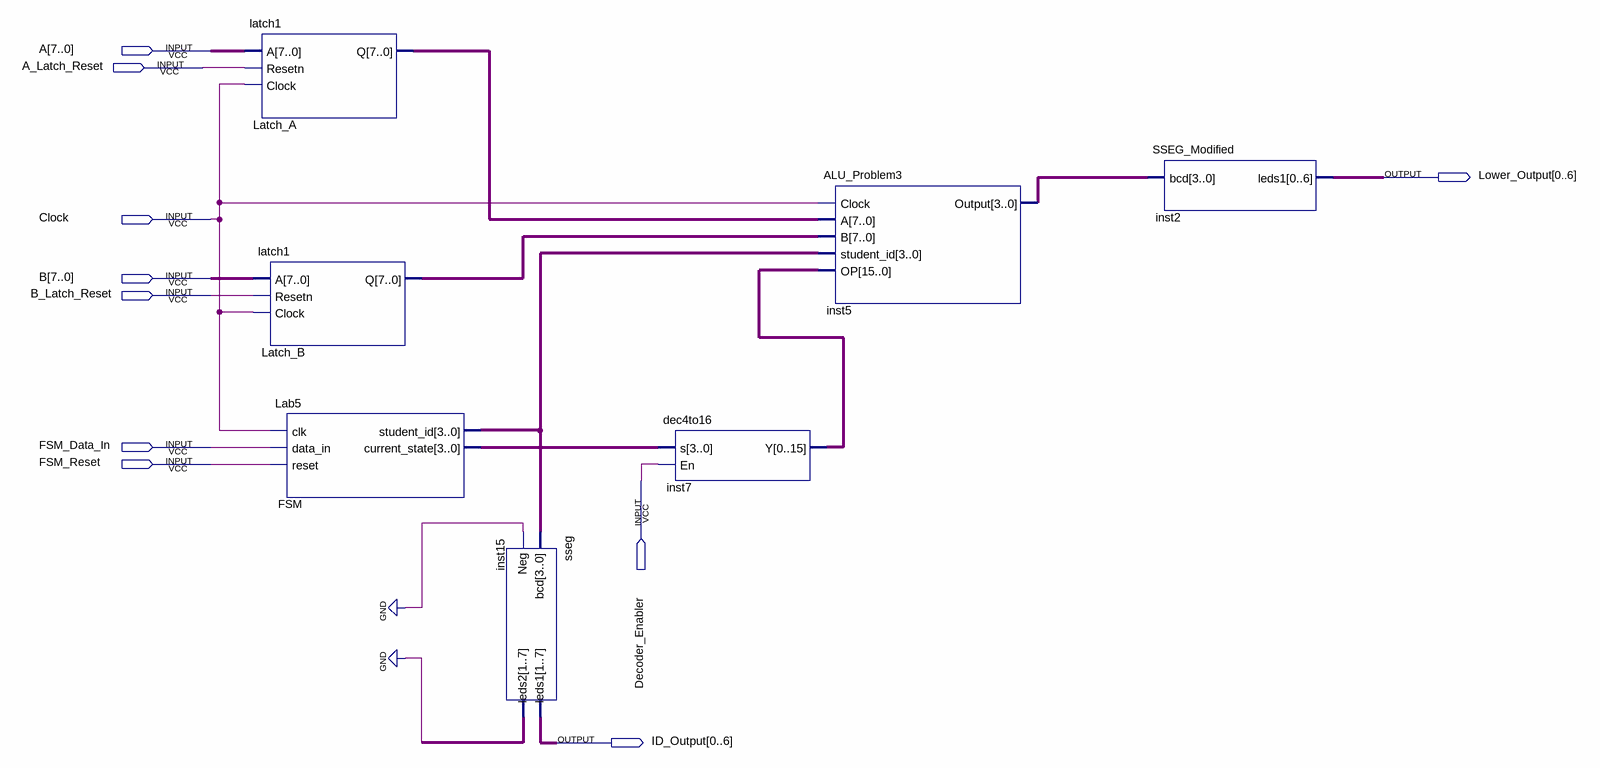
[diagram p0: schematic sheet]
// Quartus schematic Lab6Q3.bdf as structural Verilog: 7 symbols, 10 pins
module Lab6Q3 (
  input  [7:0] A,
  input  A_Latch_Reset,
  input  Clock,
  input  [7:0] B,
  input  B_Latch_Reset,
  input  FSM_Data_In,
  input  FSM_Reset,
  input  Decoder_Enabler,
  output [0:6] Lower_Output,
  output [0:6] ID_Output
);

  wire [3:0] FSM_current_state, FSM_student_id, inst5_output;
  wire [6:0] inst15_leds2;
  wire [7:0] Latch_A_q, Latch_B_q;
  wire [15:0] inst7_y;

  latch1 Latch_A (.A(A), .Resetn(A_Latch_Reset), .Clock(Clock), .Q(Latch_A_q));
  latch1 Latch_B (.A(B), .Resetn(B_Latch_Reset), .Clock(Clock), .Q(Latch_B_q));
  Lab5 FSM (
    .clk(Clock), .data_in(FSM_Data_In), .reset(FSM_Reset), .student_id(FSM_student_id),
    .current_state(FSM_current_state));
  sseg inst15 (.bcd(FSM_student_id), .Neg(1'b0), .leds1(ID_Output), .leds2(inst15_leds2));
  dec4to16 inst7 (.s(FSM_current_state), .En(Decoder_Enabler), .Y(inst7_y));
  ALU_Problem3 inst5 (
    .Clock(Clock), .A(Latch_A_q), .B(Latch_B_q), .student_id(FSM_student_id), .OP(inst7_y),
    .Output(inst5_output));
  SSEG_Modified inst2 (.bcd(inst5_output), .leds1(Lower_Output));
endmodule
